# Altium schematic sheet Sheet2.SchDoc
size A3; SheetNumber: 2; SheetTotal: 4
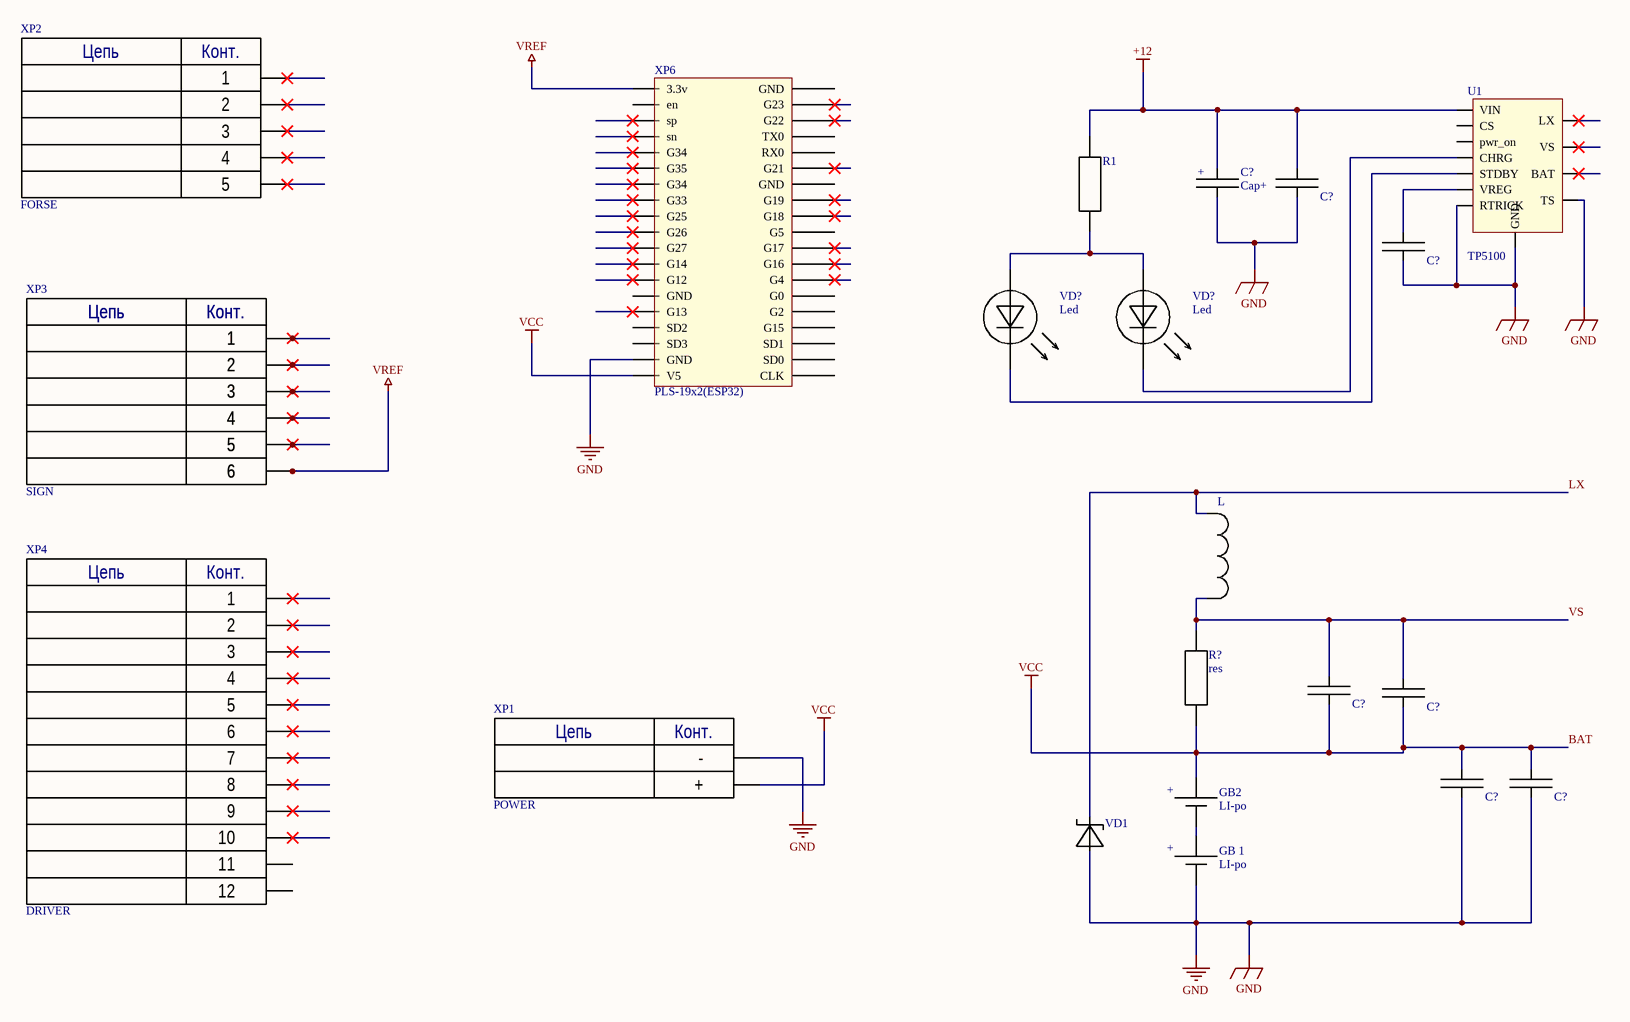
[diagram p0: Sheet2.SchDoc]

## Parts
(Parts that share a designator on the sheet are numbered #1, #2 ... from top to bottom, then left to right.)
C?#1  Cap+  [C_EL_10]
C?#2  Cap  [CAP]  (value not drawn)
C?#3  Cap  [C0805]  (value not drawn)
C?#4  Cap  [C0805]  (value not drawn)
C?#5  Cap  [C0805]  (value not drawn)
C?#6  Cap  [C0805]  (value not drawn)
C?#7  Cap  [C0805]  (value not drawn)
GB2  LI-po
GB_1  LI-po
L  INDUCROR  (value not drawn)
R1  res  [RES]  (value not drawn)
R?  res  [R0805]
U1  TP5100  [QFN-16]
VD1  Schottky diode  [DO214]  (value not drawn)
VD?#1  Led  [LED]
VD?#2  Led  [LED]
XP1  POWER  [XT30PW-M]
XP2  FORSE  [B5B-XH-A]
XP3  SIGN  [62000611622]
XP4  DRIVER  [IDC-12]
XP6  PLS-19x2(ESP32)  [PLS(ESP32)]

## Nets
+12: C?#1.1 C?#2.1 R1.2 U1.1(VIN)
BAT: C?#4.2 C?#5.2 C?#6.1 C?#7.1 GB2.1 R?.1 XP1.2(+) XP6.19(V5)  [also labelled VCC]
GND: C?#1.2 C?#2.2 C?#3.2 C?#6.2 C?#7.2 GB_1.2 U1.7(GND) U1.11(TS) U1.12(RTRICK) VD1.1 XP1.1(-) XP6.18(GND)
VREF: XP3.6 XP6.1(3.3v)
LX: L.2 VD1.2
VS: C?#4.1 C?#5.1 L.1 R?.2
NetC?#3_1: C?#3.1 U1.10(VREG)
NetGB2_2: GB2.2 GB_1.1
NetR1_1: R1.1 VD?#1.1 VD?#2.1
NetU1_14: U1.14(STDBY) VD?#1.2
NetU1_15: U1.15(CHRG) VD?#2.2

Not connected (* = marked no-connect by the designer): U1 2(LX)* 6(pwr_on) 8(VS)* 9(BAT)* 13(CS); XP2 1* 2* 3* 4* 5*; XP3 1* 2* 3* 4* 5*; XP4 1* 2* 3* 4* 5* 6* 7* 8* 9* 10* 11 12; XP6 2(en) 3(sp)* 4(sn)* 5(G34)* 6(G35)* 7(G34)* 8(G33)* 9(G25)* 10(G26)* 11(G27)* 12(G14)* 13(G12)* 14(GND) 15(G13)* 16(SD2) 17(SD3) 20(CLK) 21(SD0) 22(SD1) 23(G15) 24(G2) 25(G0) 26(G4)* 27(G16)* 28(G17)* 29(G5) 30(G18)* 31(G19)* 32(GND) 33(G21)* 34(RX0) 35(TX0) 36(G22)* 37(G23)* 38(GND)

## Notes on the sheet
- (in symbol 6pin) Цепь; Конт.
- (in symbol Cap+) +
- (in symbol LI-po) +
- (in symbol PLD-12) Цепь; Конт.
- (in symbol PLS-5) Цепь; Конт.
- (in symbol XT30PW-M) Цепь; Конт.

## Library data of the parts
XP1 = XT30PW-M
XP2 = PLS-5
XP3 = 6pin
XP4 = PLD-12